# Altium schematic sheet Power sTM.SchDoc
size A4; SheetNumber: 5; SheetTotal: 5
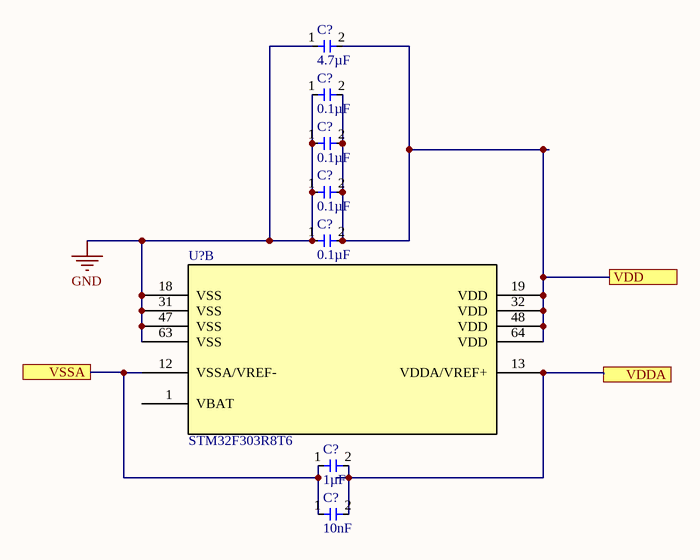
[diagram p0: Power sTM.SchDoc]

## Parts
(Parts that share a designator on the sheet are numbered #1, #2 ... from top to bottom, then left to right.)
C?#1  4.7µF  [0603]
C?#2  0.1µF  [0603]
C?#3  0.1µF  [0603]
C?#4  0.1µF  [0603]
C?#5  0.1µF  [0603]
C?#6  1µF  [0603]
C?#7  10nF  [0603]
U?  STM32F303R8T6  [LQFP64-10x10mm]  (part B of 2)

## Ports
VDD, VDDA, VSSA

## Nets
GND: C?#1.1 C?#2.1 C?#3.1 C?#4.1 C?#5.1 U?.18(VSS) U?.31(VSS) U?.47(VSS) U?.63(VSS)
VDD: C?#1.2 C?#2.2 C?#3.2 C?#4.2 C?#5.2 U?.19(VDD) U?.32(VDD) U?.48(VDD) U?.64(VDD) ; port VDD
VDDA: C?#6.2 C?#7.2 U?.13(VDDA/VREF+) ; port VDDA
VSSA: C?#6.1 C?#7.1 U?.12(VSSA/VREF-) ; port VSSA

Not connected (* = marked no-connect by the designer): U? 1(VBAT)

## Library data of the parts
C?#1 = 0603ZD475KAT2A: AVX - 0603ZD475KAT2A - SMD Multilayer Ceramic Capacitor, 4.7 µF, 10 V, 0603 [1608 Metric], ± 10%, X5R, AVX 0603 MLCC; Manufacturer: Kyocera AVX; Capacitance: 4.7uF; Voltage Rating: 10V; Dissipation Factor: 3.5%; Supplier 1: Farnell; Manufacturer Part Number: 0603ZD475KAT2A; RoHS: Yes; Category: Ceramic Capacitors; Stock 1: 14307; Pricing 1: 10=0.39800, 100=0.22700, 500=0.14700, 1000=0.11700, 2000=0.09810, 4000=0.08400, 20000=0.05250 (EUR); Mount: Surface Mount; Case/Package: 0603; Number of Pins: 2; Case Code (Imperial): 0603; Case Code (Metric): 1608; Contact Plating: Tin,Matte; Min Operating Temperature: -55°C; Max Operating Temperature: 85°C; Tolerance: 10%; Dielectric: X5R; Package Quantity: 1; Voltage Rating (DC): 10V; Packaging: Tape and Reel; Termination: SMD/SMT; Series: -; Voltage: 10V; Construction: Flat; Length: 1.6mm; Width: 0.81mm; Height: 0.9mm; Depth: 0.81mm; Thickness: 0.035inch; Radiation Hardening: No; REACH SVHC: No SVHC; Lead Free: Lead Free; RoHS Compliant: Yes; ComponentLink1URL: https://datasheet.ciiva.com/1458/1796776-1458211.pdf?src-supplier=Element14; ComponentLink1Description: https://datasheet.ciiva.com/1458/1796776-1458211.pdf?src-supplier=Element14; ComponentLink2URL: https://datasheet.ciiva.com/15212/getdatasheetpartid-179504-15212405.pdf?src-supplier=Verical; ComponentLink2Description: https://datasheet.ciiva.com/15212/getdatasheetpartid-179504-15212405.pdf?src-supplier=Verical; ComponentLink3URL: https://datasheet.ciiva.com/11570/cx5r-11570838.pdf?src-supplier=Avnet; ComponentLink3Description: https://datasheet.ciiva.com/11570/cx5r-11570838.pdf?src-supplier=Avnet; ComponentLink4URL: https://datasheet.ciiva.com/6269/cx5r-6269191.pdf?src-supplier=Digi-Key; ComponentLink4Description: https://datasheet.ciiva.com/6269/cx5r-6269191.pdf?src-supplier=Digi-Key; ComponentLink5URL: https://datasheet.ciiva.com/14905/cx5r-14905225.pdf?src-supplier=Digi-Key; ComponentLink5Description: https://datasheet.ciiva.com/14905/cx5r-14905225.pdf?src-supplier=Digi-Key; ComponentLink6URL: https://datasheet.ciiva.com/7855/1666675-7855114.pdf?src-supplier=Element14; ComponentLink6Description: https://datasheet.ciiva.com/7855/1666675-7855114.pdf?src-supplier=Element14; ComponentLink7URL: https://datasheet.ciiva.com/14905/cx5r-14905226.pdf?src-supplier=Digi-Key; ComponentLink7Description: https://datasheet.ciiva.com/14905/cx5r-14905226.pdf?src-supplier=Digi-Key; ComponentLink8URL: https://datasheet.ciiva.com/7614/cx5r-7614716.pdf?src-supplier=Digi-Key; ComponentLink8Description: https://datasheet.ciiva.com/7614/cx5r-7614716.pdf?src-supplier=Digi-Key; ComponentLink9URL: https://datasheet.ciiva.com/28611/1598274-28611548.pdf?src-supplier=Element14; ComponentLink9Description: https://datasheet.ciiva.com/28611/1598274-28611548.pdf?src-supplier=Element14; ComponentLink10URL: https://datasheet.ciiva.com/22700/1796776-22700575.pdf?src-supplier=Element14; ComponentLink10Description: https://datasheet.ciiva.com/22700/1796776-22700575.pdf?src-supplier=Element14; Supplier Part Number 1: 1833806
C?#2-C?#5 = 0603YC104KAT2A: Cap Ceramic 0.1uF 16V X7R 10% SMD 0603 125C Paper T/R; Manufacturer: Kyocera AVX; Capacitance: 100nF; Insulation Resistance: 100GR; Dissipation Factor: 3.5%; Supplier 1: Farnell; Manufacturer Part Number: 0603YC104KAT2A; RoHS: Yes; Category: Ceramic Capacitors; Stock 1: 61599; Pricing 1: 10=0.06680, 100=0.05510, 500=0.03380, 1000=0.02430, 2000=0.02420, 4000=0.01760, 20000=0.01470 (EUR); Mount: Surface Mount,PCB; Case/Package: 0603; Number of Pins: 2; Case Code (Metric): 1608; Case Code (Imperial): 0603; Contact Plating: Tin,Matte; Min Operating Temperature: -55°C; Max Operating Temperature: 125°C; Tolerance: 10%; Dielectric: X7R; Packaging: Tape and Reel; Voltage Rating (DC): 16V; Voltage: 16V; Voltage Rating: 16V; Package Quantity: 1; Termination: SMD/SMT; Series: -; Construction: Flat; Length: 1.6mm; Width: 0.032inch; Height: 0.9mm; Depth: 0.81mm; Thickness: 0.035inch; Radiation Hardening: No; REACH SVHC: No SVHC; Lead Free: Lead Free; RoHS Compliant: Yes; ComponentLink1URL: https://datasheet.ciiva.com/11788/0900766b80dc2409-11788525.pdf?src-supplier=RSComponents; ComponentLink1Description: https://datasheet.ciiva.com/11788/0900766b80dc2409-11788525.pdf?src-supplier=RSComponents; ComponentLink2URL: https://datasheet.ciiva.com/1458/84526-1458128.pdf?src-supplier=Element14; ComponentLink2Description: https://datasheet.ciiva.com/1458/84526-1458128.pdf?src-supplier=Element14; ComponentLink3URL: https://datasheet.ciiva.com/1458/84526-1458129.pdf?src-supplier=Element14; ComponentLink3Description: https://datasheet.ciiva.com/1458/84526-1458129.pdf?src-supplier=Element14; ComponentLink4URL: https://datasheet.ciiva.com/150/cx7r-150230.pdf?src-supplier=Digi-Key; ComponentLink4Description: https://datasheet.ciiva.com/150/cx7r-150230.pdf?src-supplier=Digi-Key; ComponentLink5URL: https://datasheet.ciiva.com/28613/683218-28613286.pdf?src-supplier=Element14; ComponentLink5Description: https://datasheet.ciiva.com/28613/683218-28613286.pdf?src-supplier=Element14; ComponentLink6URL: https://datasheet.ciiva.com/150/cx7r-150231.pdf?src-supplier=Digi-Key; ComponentLink6Description: https://datasheet.ciiva.com/150/cx7r-150231.pdf?src-supplier=Digi-Key; ComponentLink7URL: https://datasheet.ciiva.com/150/cx7r-150232.pdf?src-supplier=Digi-Key; ComponentLink7Description: https://datasheet.ciiva.com/150/cx7r-150232.pdf?src-supplier=Digi-Key; ComponentLink8URL: https://datasheet.ciiva.com/5427/cx7r-218113-5427486.pdf?src-supplier=Mouser; ComponentLink8Description: https://datasheet.ciiva.com/5427/cx7r-218113-5427486.pdf?src-supplier=Mouser; ComponentLink9URL: https://datasheet.ciiva.com/14585/70001075-14585102.pdf?src-supplier=Allied+Electronics; ComponentLink9Description: https://datasheet.ciiva.com/14585/70001075-14585102.pdf?src-supplier=Allied+Electronics; ComponentLink10URL: https://datasheet.ciiva.com/11464/cx7r-11464543.pdf?src-supplier=Avnet; ComponentLink10Description: https://datasheet.ciiva.com/11464/cx7r-11464543.pdf?src-supplier=Avnet; Supplier Part Number 1: 1327679
C?#6 = 0603YD105KAT2A: AVX - 0603YD105KAT2A - SMD Multilayer Ceramic Capacitor, 1 µF, 16 V, 0603 [1608 Metric], ± 10%, X5R, AVX 0603 MLCC; Manufacturer: Kyocera AVX; Capacitance: 1uF; Voltage Rating: 16V; Dissipation Factor: 12.5%; Insulation Resistance: 10GR; Supplier 1: Farnell; Manufacturer Part Number: 0603YD105KAT2A; RoHS: Yes; Category: Ceramic Capacitors; Stock 1: 33961; Pricing 1: 10=0.07550, 100=0.05170, 500=0.03710, 1000=0.03000, 2000=0.02970, 4000=0.02940, 20000=0.02000 (EUR); Mount: Surface Mount; Case/Package: 0603; Number of Pins: 2; Case Code (Metric): 1608; Case Code (Imperial): 0603; Min Operating Temperature: -55°C; Max Operating Temperature: 85°C; Tolerance: 10%; Dielectric: X5R; Voltage Rating (DC): 16V; Packaging: Tape and Reel; Voltage: 16V; Package Quantity: 1; Termination: SMD/SMT; Series: -; Construction: Flat; Length: 1.6mm; Width: 0.81mm; Height: 0.9mm; Depth: 0.81mm; Thickness: 0.035inch; Radiation Hardening: No; REACH SVHC: No SVHC; Lead Free: Lead Free; RoHS Compliant: Yes; ComponentLink1URL: https://datasheet.ciiva.com/11788/0900766b80def1a5-11788563.pdf?src-supplier=RSComponents; ComponentLink1Description: https://datasheet.ciiva.com/11788/0900766b80def1a5-11788563.pdf?src-supplier=RSComponents; ComponentLink2URL: https://datasheet.ciiva.com/34303/2012654-34303835.pdf?src-supplier=Jameco; ComponentLink2Description: https://datasheet.ciiva.com/34303/2012654-34303835.pdf?src-supplier=Jameco; ComponentLink3URL: https://datasheet.ciiva.com/2987/cx5r-2987890.pdf?src-supplier=Avnet; ComponentLink3Description: https://datasheet.ciiva.com/2987/cx5r-2987890.pdf?src-supplier=Avnet; ComponentLink4URL: https://datasheet.ciiva.com/5412/cx5r-5412550.pdf?src-supplier=Mouser; ComponentLink4Description: https://datasheet.ciiva.com/5412/cx5r-5412550.pdf?src-supplier=Mouser; ComponentLink5URL: https://datasheet.ciiva.com/150/cx5r-150392.pdf?src-supplier=Digi-Key; ComponentLink5Description: https://datasheet.ciiva.com/150/cx5r-150392.pdf?src-supplier=Digi-Key; ComponentLink6URL: https://datasheet.ciiva.com/14590/70001028-14590632.pdf?src-supplier=Allied+Electronics; ComponentLink6Description: https://datasheet.ciiva.com/14590/70001028-14590632.pdf?src-supplier=Allied+Electronics; ComponentLink7URL: https://datasheet.ciiva.com/150/cx5r-150393.pdf?src-supplier=Digi-Key; ComponentLink7Description: https://datasheet.ciiva.com/150/cx5r-150393.pdf?src-supplier=Digi-Key; ComponentLink8URL: https://datasheet.ciiva.com/1458/84508-1458137.pdf?src-supplier=Element14; ComponentLink8Description: https://datasheet.ciiva.com/1458/84508-1458137.pdf?src-supplier=Element14; ComponentLink9URL: https://datasheet.ciiva.com/150/cx5r-150394.pdf?src-supplier=Digi-Key; ComponentLink9Description: https://datasheet.ciiva.com/150/cx5r-150394.pdf?src-supplier=Digi-Key; ComponentLink10URL: https://datasheet.ciiva.com/1458/84508-1458138.pdf?src-supplier=Element14; ComponentLink10Description: https://datasheet.ciiva.com/1458/84508-1458138.pdf?src-supplier=Element14; ComponentLink11URL: https://datasheet.ciiva.com/14586/70001028-14586715.pdf?src-supplier=Allied+Electronics; ComponentLink11Description: https://datasheet.ciiva.com/14586/70001028-14586715.pdf?src-supplier=Allied+Electronics; Supplier Part Number 1: 1327680
C?#7 = 0603YC103KAT2A: AVX - 0603YC103KAT2A - SMD Multilayer Ceramic Capacitor, 10000 pF, 16 V, 0603 [1608 Metric], ± 10%, X7R, AVX 0603 MLCC; Manufacturer: Kyocera AVX; Voltage Rating (DC): 16V; Dissipation Factor: 3.5%; Supplier 1: Farnell; Manufacturer Part Number: 0603YC103KAT2A; RoHS: Yes; Category: Ceramic Capacitors; Stock 1: 10219; Pricing 1: 10=0.05050, 100=0.04160, 500=0.03270, 1000=0.02510, 2000=0.02040, 4000=0.01630, 20000=0.01090 (EUR); Mount: Surface Mount; Case/Package: 0603; Case Code (Metric): 1608; Case Code (Imperial): 0603; Min Operating Temperature: -55°C; Max Operating Temperature: 125°C; Capacitance: 10nF; Tolerance: 10%; Dielectric: X7R; Packaging: Tape and Reel; Voltage Rating: 16V; Package Quantity: 1; Termination: SMD/SMT; Voltage: 16V; Series: -; Construction: Flat; Length: 1.6mm; Width: 0.032inch; Depth: 0.81mm; Thickness: 0.035inch; Radiation Hardening: No; REACH SVHC: No SVHC; Lead Free: Lead Free; RoHS Compliant: Yes; ComponentLink1URL: https://datasheet.ciiva.com/150/cx7r-150743.pdf?src-supplier=Digi-Key; ComponentLink1Description: https://datasheet.ciiva.com/150/cx7r-150743.pdf?src-supplier=Digi-Key; ComponentLink2URL: https://datasheet.ciiva.com/22683/1679506-22683367.pdf?src-supplier=Element14; ComponentLink2Description: https://datasheet.ciiva.com/22683/1679506-22683367.pdf?src-supplier=Element14; ComponentLink3URL: https://datasheet.ciiva.com/150/cx7r-150744.pdf?src-supplier=Digi-Key; ComponentLink3Description: https://datasheet.ciiva.com/150/cx7r-150744.pdf?src-supplier=Digi-Key; ComponentLink4URL: https://datasheet.ciiva.com/150/cx7r-150745.pdf?src-supplier=Digi-Key; ComponentLink4Description: https://datasheet.ciiva.com/150/cx7r-150745.pdf?src-supplier=Digi-Key; ComponentLink5URL: https://datasheet.ciiva.com/22699/1679506-22699610.pdf?src-supplier=Element14; ComponentLink5Description: https://datasheet.ciiva.com/22699/1679506-22699610.pdf?src-supplier=Element14; ComponentLink6URL: https://datasheet.ciiva.com/5412/cx7r-218113-5412060.pdf?src-supplier=Mouser; ComponentLink6Description: https://datasheet.ciiva.com/5412/cx7r-218113-5412060.pdf?src-supplier=Mouser; ComponentLink7URL: https://datasheet.ciiva.com/7855/1679506-7855103.pdf?src-supplier=Element14; ComponentLink7Description: https://datasheet.ciiva.com/7855/1679506-7855103.pdf?src-supplier=Element14; ComponentLink8URL: https://datasheet.ciiva.com/16375/cx7r-16375919.pdf?src-supplier=Future+Electronics; ComponentLink8Description: https://datasheet.ciiva.com/16375/cx7r-16375919.pdf?src-supplier=Future+Electronics; Supplier Part Number 1: 2280661
U? = STM32F303R8T6: No Description Available; Vendor: STMicroelectronics; Built_By: EMA_UL_Team; SourceLibrary: Updates_to_database_2020-10-19; Manufacturer_Part_Number: STM32F303R8T6; Copyright: Copyright (C) 2018 Accelerated Designs. All rights reserved; RefDes: RefDes; Type: DEV